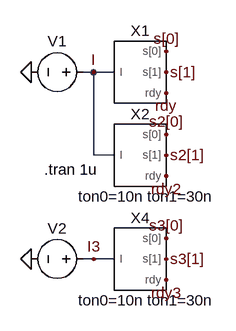
[diagram p0: schematic test-sm_seq_timer_2state.asc]
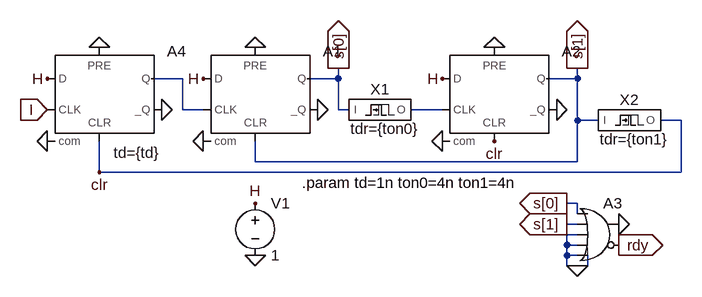
[diagram p1: sub-circuit sm_seq_timer_2state.asc]
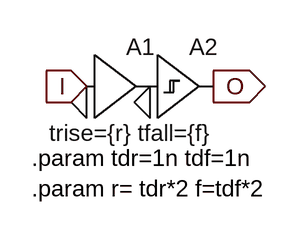
[diagram p2: sub-circuit delay.asc]
test-sm_seq_timer_2state.asc, the LTspice schematic file:
Version 4
SHEET 1 880 700
WIRE 32 192 16 192
WIRE 64 192 32 192
WIRE 32 320 32 192
WIRE 64 320 32 320
WIRE 32 480 16 480
WIRE 64 480 32 480
FLAG -64 192 0
FLAG 32 192 I
FLAG 144 160 s[0]
FLAG 144 192 s[1]
FLAG 144 224 rdy
FLAG 144 288 s2[0]
FLAG 144 320 s2[1]
FLAG 144 352 rdy2
FLAG -64 480 0
FLAG 32 480 I3
FLAG 144 448 s3[0]
FLAG 144 480 s3[1]
FLAG 144 512 rdy3
SYMBOL sm_seq_timer_2state 96 192 R0
SYMATTR InstName X1
SYMBOL voltage 32 192 R90
WINDOW 0 -32 56 VBottom 2
WINDOW 3 32 56 Invisible 2
WINDOW 123 0 0 Left 0
WINDOW 39 0 0 Left 0
SYMATTR InstName V1
SYMATTR Value PULSE(0 1 100n 0 0 100n 200n)
SYMBOL sm_seq_timer_2state 96 320 R0
WINDOW 39 18 79 Bottom 2
SYMATTR InstName X2
SYMATTR SpiceLine ton0=10n ton1=30n
SYMBOL voltage 32 480 R90
WINDOW 0 -32 56 VBottom 2
WINDOW 3 32 56 Invisible 2
WINDOW 123 0 0 Left 0
WINDOW 39 0 0 Left 0
SYMATTR InstName V2
SYMATTR Value PULSE(0 1 15n 0 0 15n 30n)
SYMBOL sm_seq_timer_2state 96 480 R0
WINDOW 39 18 79 Bottom 2
SYMATTR InstName X4
SYMATTR SpiceLine ton0=10n ton1=30n
TEXT -44 342 Left 2 !.tran 1u

sm_seq_timer_2state.asc, the sub-circuit schematic file:
Version 4
SHEET 1 880 712
WIRE -1152 112 -1200 112
WIRE -912 112 -912 96
WIRE -912 112 -960 112
WIRE -544 112 -544 96
WIRE -544 112 -592 112
WIRE -1152 160 -1152 112
WIRE -1120 160 -1152 160
WIRE -912 160 -912 112
WIRE -896 160 -912 160
WIRE -752 160 -800 160
WIRE -544 176 -544 112
WIRE -512 176 -544 176
WIRE -384 176 -416 176
WIRE -1040 240 -1040 208
WIRE -544 240 -544 176
WIRE -544 240 -1040 240
WIRE -1280 256 -1280 208
WIRE -384 256 -384 176
WIRE -384 256 -1280 256
WIRE -544 304 -560 304
WIRE -544 320 -544 304
WIRE -544 336 -560 336
WIRE -544 352 -560 352
WIRE -560 368 -560 352
WIRE -544 368 -560 368
WIRE -560 384 -560 368
WIRE -544 384 -560 384
WIRE -560 400 -560 384
WIRE -544 400 -560 400
WIRE -528 400 -528 384
WIRE -528 400 -544 400
FLAG -1120 208 0
FLAG -752 208 0
FLAG -1040 64 0
FLAG -1360 160 I
IOPIN -1360 160 In
FLAG -672 64 0
FLAG -544 96 s[1]
IOPIN -544 96 Out
FLAG -944 160 0
FLAG -576 160 0
FLAG -1040 384 0
FLAG -1040 304 H
FLAG -1120 112 H
FLAG -752 112 H
FLAG -912 96 s[0]
IOPIN -912 96 Out
FLAG -544 400 0
FLAG -480 336 0
FLAG -560 304 s[0]
IOPIN -560 304 Out
FLAG -560 336 s[1]
IOPIN -560 336 Out
FLAG -480 368 rdy
IOPIN -480 368 Out
FLAG -1360 208 0
FLAG -1280 64 0
FLAG -1184 160 0
FLAG -1360 112 H
FLAG -1280 256 clr
FLAG -672 208 clr
SYMBOL voltage -1040 288 R0
SYMATTR InstName V1
SYMATTR Value 1
SYMBOL Digital\\dflop -1040 64 R0
WINDOW 3 0 0 Invisible 0
SYMATTR Value td=0.5n
SYMATTR InstName A1
SYMBOL Digital\\dflop -672 64 R0
WINDOW 3 0 0 Invisible 0
SYMATTR Value td=0.5n
SYMATTR InstName A2
SYMBOL Digital\\or -512 288 R0
SYMATTR InstName A3
SYMBOL Digital\\dflop -1280 64 R0
WINDOW 3 22 162 Left 2
SYMATTR Value td={td}
SYMATTR InstName A4
SYMBOL delay -848 160 R0
WINDOW 39 8 45 Bottom 2
SYMATTR SpiceLine tdr={ton0}
SYMATTR InstName X1
SYMBOL delay -464 176 R0
WINDOW 39 8 45 Bottom 2
SYMATTR SpiceLine tdr={ton1}
SYMATTR InstName X2
TEXT -968 272 Left 2 !.param td=1n ton0=4n ton1=4n

delay.asc, the sub-circuit schematic file:
Version 4
SHEET 1 880 680
FLAG 144 176 0
FLAG 208 176 0
FLAG 272 160 O
IOPIN 272 160 Out
FLAG 144 160 I
IOPIN 144 160 In
SYMBOL Digital\\buf1 144 96 R0
WINDOW 3 -38 111 Left 2
SYMATTR Value trise={r} tfall={f}
SYMATTR InstName A1
SYMBOL Digital\\schmtbuf 208 96 R0
SYMATTR InstName A2
TEXT 88 232 Left 2 !.param tdr=1n tdf=1n\n.param r= tdr*2 f=tdf*2

The netlist it stands for:
* test-sm_seq_timer_2state.asc
XX1 I rdy s[0] s[1] sm_seq_timer_2state
V1 I 0 PULSE(0 1 100n 0 0 100n 200n)
XX2 I rdy2 s2[0] s2[1] sm_seq_timer_2state params: ton0=10n ton1=30n
V2 I3 0 PULSE(0 1 15n 0 0 15n 30n)
XX4 I3 rdy3 s3[0] s3[1] sm_seq_timer_2state params: ton0=10n ton1=30n

* block symbol definitions
.subckt sm_seq_timer_2state I rdy s[0] s[1]
V1 H 0 1
A1 H 0 N001 0 s[1] 0 s[0] 0 DFLOP td=0.5n
A2 H 0 N002 0 clr 0 s[1] 0 DFLOP td=0.5n
A3 s[0] s[1] 0 0 0 rdy 0 0 OR
A4 H 0 I 0 clr 0 N001 0 DFLOP td={td}
XX1 s[0] N002 delay params: tdr={ton0}
XX2 s[1] clr delay params: tdr={ton1}
.param td=1n ton0=4n ton1=4n
.ends sm_seq_timer_2state

.subckt delay I O
A1 I 0 0 0 0 0 P001 0 BUF trise={r} tfall={f}
A2 P001 0 0 0 0 0 O 0 SCHMITT
.param tdr=1n tdf=1n
.param r= tdr*2 f=tdf*2
.ends delay

.tran 1u
.backanno
.end